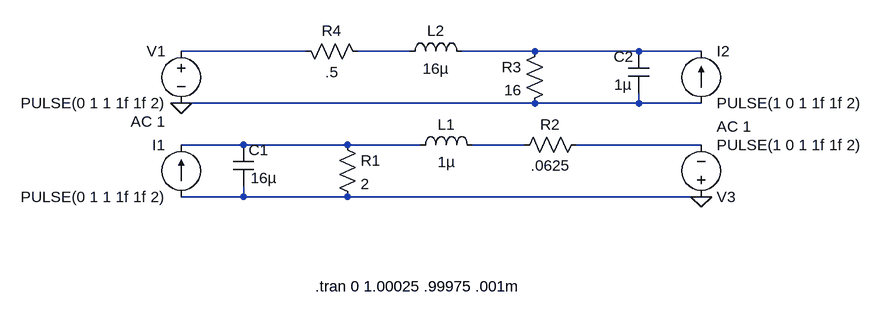
[diagram p0: schematic 2-b.asc]
2-b.asc, the LTspice schematic file:
Version 4
SHEET 1 880 680
WIRE -112 -32 -304 -32
WIRE 48 -32 -32 -32
WIRE 240 -32 128 -32
WIRE 400 -32 240 -32
WIRE 496 -32 400 -32
WIRE 240 48 -304 48
WIRE 400 48 400 32
WIRE 400 48 240 48
WIRE 496 48 400 48
WIRE -208 112 -304 112
WIRE -48 112 -208 112
WIRE 64 112 -48 112
WIRE 224 112 144 112
WIRE 496 112 304 112
WIRE -208 192 -208 176
WIRE -208 192 -304 192
WIRE -48 192 -208 192
WIRE 496 192 -48 192
FLAG 496 192 0
FLAG -304 48 0
SYMBOL voltage 496 208 M180
WINDOW 123 24 124 Left 2
WINDOW 39 24 152 Left 2
SYMATTR InstName V3
SYMATTR Value PULSE(1 0 1 1f 1f 2)
SYMATTR Value2 AC 1
SYMBOL current -304 192 R180
WINDOW 0 24 80 Left 2
WINDOW 3 24 0 Left 2
WINDOW 123 0 0 Left 2
WINDOW 39 0 0 Left 2
SYMATTR InstName I1
SYMATTR Value PULSE(0 1 1 1f 1f 2)
SYMBOL cap -224 112 R0
WINDOW 3 27 51 Left 2
SYMATTR InstName C1
SYMATTR Value 16µ
SYMBOL ind 48 128 R270
WINDOW 0 32 56 VTop 2
WINDOW 3 5 56 VBottom 2
SYMATTR InstName L1
SYMATTR Value 1µ
SYMBOL res -64 96 R0
SYMATTR InstName R1
SYMATTR Value 2
SYMBOL res 320 96 R90
WINDOW 0 0 56 VBottom 2
WINDOW 3 32 56 VTop 2
SYMATTR InstName R2
SYMATTR Value .0625
SYMBOL voltage -304 -48 M0
WINDOW 123 24 124 Left 2
WINDOW 39 24 152 Left 2
SYMATTR InstName V1
SYMATTR Value PULSE(0 1 1 1f 1f 2)
SYMATTR Value2 AC 1
SYMBOL current 496 48 M180
WINDOW 0 24 80 Left 2
WINDOW 3 24 0 Left 2
WINDOW 123 0 0 Left 2
WINDOW 39 0 0 Left 2
SYMATTR InstName I2
SYMATTR Value PULSE(1 0 1 1f 1f 2)
SYMBOL cap 416 -32 M0
WINDOW 3 27 51 Left 2
SYMATTR InstName C2
SYMATTR Value 1µ
SYMBOL ind 144 -16 M270
WINDOW 0 32 56 VTop 2
WINDOW 3 5 56 VBottom 2
SYMATTR InstName L2
SYMATTR Value 16µ
SYMBOL res 256 -48 M0
SYMATTR InstName R3
SYMATTR Value 16
SYMBOL res -128 -48 M90
WINDOW 0 0 56 VBottom 2
WINDOW 3 32 56 VTop 2
SYMATTR InstName R4
SYMATTR Value .5
TEXT -98 330 Left 2 !.tran 0 1.00025 .99975 .001m

The netlist it stands for:
* 2-b.asc
V3 0 N006 PULSE(1 0 1 1f 1f 2) AC 1
I1 0 N004 PULSE(0 1 1 1f 1f 2)
C1 N004 0 16µ
L1 N004 N005 1µ
R1 N004 0 2
R2 N006 N005 .0625
V1 N001 0 PULSE(0 1 1 1f 1f 2) AC 1
I2 0 N003 PULSE(1 0 1 1f 1f 2)
C2 N003 0 1µ
L2 N003 N002 16µ
R3 N003 0 16
R4 N001 N002 .5
.tran 0 1.00025 .99975 .001m
.backanno
.end